# Altium schematic sheet 03-PeripheralPart-V2.3.SchDoc
size A4
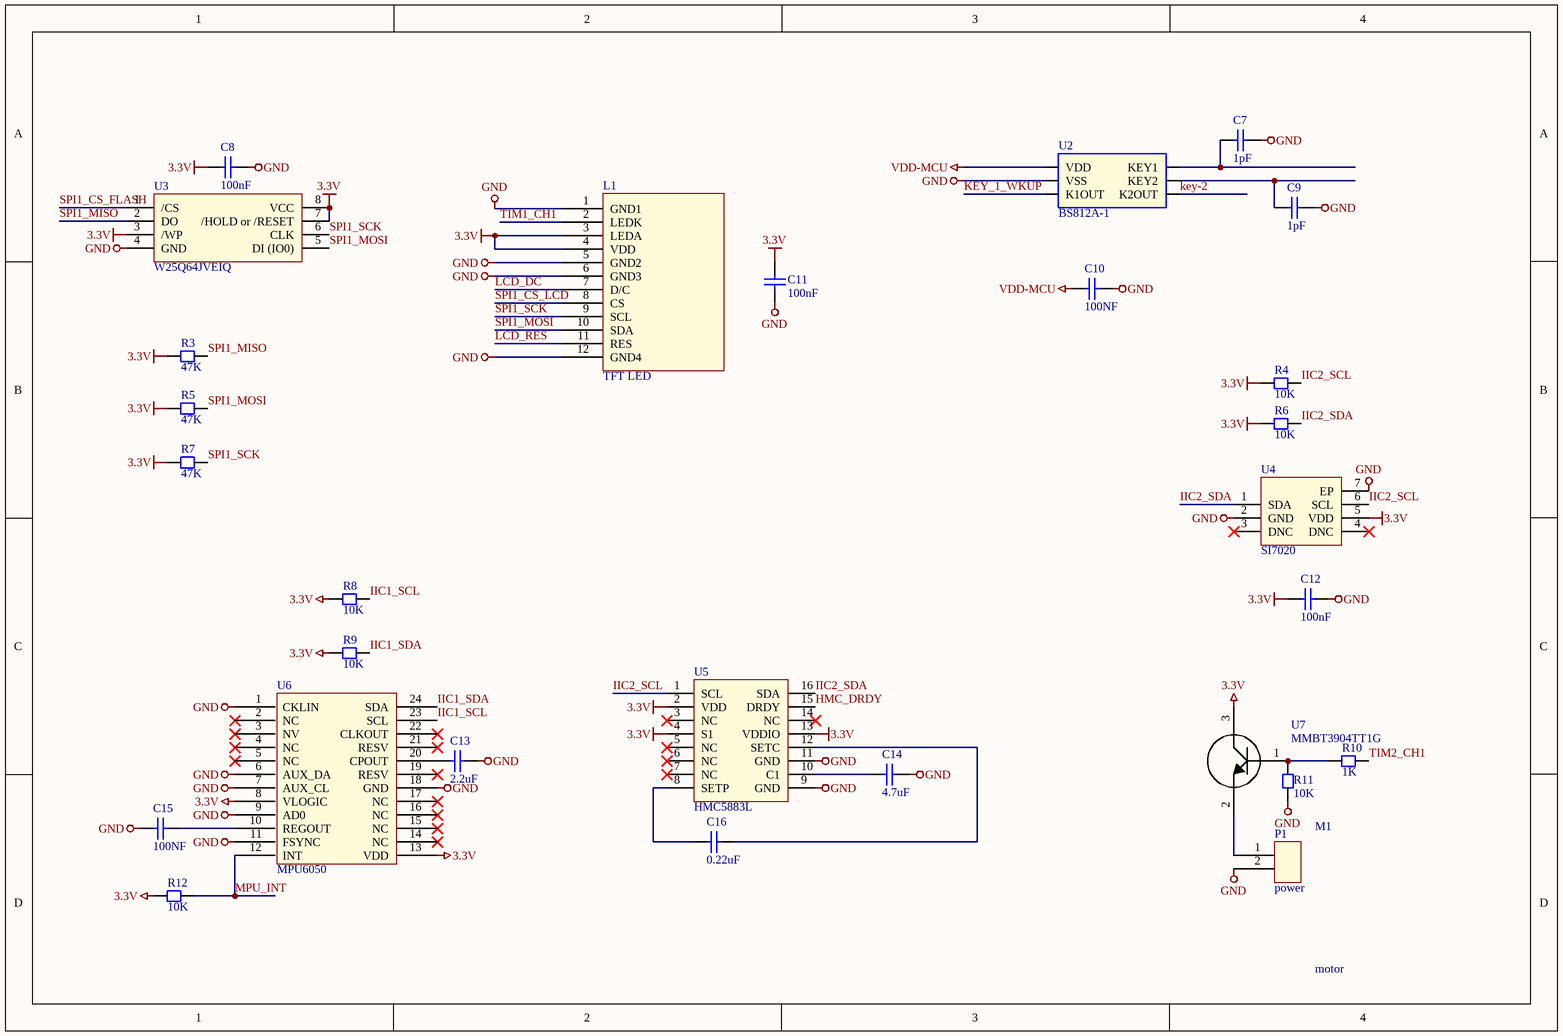
[diagram p0: 03-PeripheralPart-V2.3.SchDoc]

## Parts
C7  1pF  [CC1005-0402]
C8  100nF  [CC1005-0402]
C9  1pF  [CC1005-0402]
C10  100NF  [CC1005-0402]
C11  100nF  [CC1005-0402]
C12  100nF  [CC1005-0402]
C13  2.2uF  [CC1005-0402]
C14  4.7uF  [CC1005-0402]
C15  100NF  [CC1005-0402]
C16  0.22uF  [CC1005-0402]
L1  TFT LED  [LCD-1.3-(2)]
M1  motor  [motor]
P1  power  [POWER-3.7V]
R3  47K  [CR1005-0402]
R4  10K  [CR1005-0402]
R5  47K  [CR1005-0402]
R6  10K  [CR1005-0402]
R7  47K  [CR1005-0402]
R8  10K  [CR1005-0402]
R9  10K  [CR1005-0402]
R10  1K  [CR1005-0402]
R11  10K  [CR1005-0402]
R12  10K  [CR1005-0402]
U2  BS812A-1  [SOT23-6]
U3  W25Q64JVEIQ  [WSON-8_L8.0-W6.10-P1.27-TL-EP]
U4  SI7020  [DFN-6]
U5  HMC5883L  [LPCC-16_L3.0-W3.0-P0.50-BL]
U6  MPU6050  [QFN24 - duplicate]
U7  MMBT3904TT1G  [SOT-416]

## Nets
3.3V: C8.1 C11.1 C12.1 L1.3(LEDA) L1.4(VDD) R3.2 R4.2 R5.2 R6.2 R7.2 R8.2 R9.2 R12.2 U3.3(/WP) U3.7(/HOLD_or_/RESET) U3.8(VCC) U4.5(VDD) U5.2(VDD) U5.4(S1) U5.13(VDDIO) U6.8(VLOGIC) U6.13(VDD) U7.3
GND: C7.2 C8.2 C9.2 C10.1 C11.2 C12.2 C13.2 C14.2 C15.1 L1.1(GND1) L1.5(GND2) L1.6(GND3) L1.12(GND4) P1.2 R11.2 U2.2(VSS) U3.4(GND) U4.2(GND) U4.7(EP) U5.9(GND) U5.11(GND) U6.1(CKLIN) U6.6(AUX_DA) U6.7(AUX_CL) U6.9(AD0) U6.11(FSYNC) U6.18(GND)
VDD-MCU: C10.2 U2.1(VDD)
HMC_DRDY: U5.15(DRDY)
IIC1_SCL: R8.1 U6.23(SCL)
IIC1_SDA: R9.1 U6.24(SDA)
IIC2_SCL: R4.1 U4.6(SCL) U5.1(SCL)
IIC2_SDA: R6.1 U4.1(SDA) U5.16(SDA)
key-2: U2.4(K2OUT)
KEY_1_WKUP: U2.3(K1OUT)
LCD_DC: L1.7(D/C)
LCD_RES: L1.11(RES)
MPU_INT: R12.1 U6.12(INT)
SPI1_CS_FLASH: U3.1(/CS)
SPI1_CS_LCD: L1.8(CS)
SPI1_MISO: R3.1 U3.2(DO)
SPI1_MOSI: L1.10(SDA) R5.1 U3.5(DI_(IO0))
SPI1_SCK: L1.9(SCL) R7.1 U3.6(CLK)
TIM1_CH1: L1.2(LEDK)
TIM2_CH1: R10.1
NetC7_1: C7.1 U2.6(KEY1)
NetC9_1: C9.1 U2.5(KEY2)
NetC13_1: C13.1 U6.20(CPOUT)
NetC14_1: C14.1 U5.10(C1)
NetC15_2: C15.2 U6.10(REGOUT)
NetC16_1: C16.1 U5.8(SETP)
NetC16_2: C16.2 U5.12(SETC)
NetP1_1: P1.1 U7.2
NetR10_2: R10.2 R11.1 U7.1

Not connected (* = marked no-connect by the designer): U4 3(DNC)* 4(DNC)*; U5 3(NC)* 5(NC)* 6(NC)* 7(NC)* 14(NC)*; U6 2(NC)* 3(NV)* 4(NC)* 5(NC)* 14(NC)* 15(NC)* 16(NC)* 17(NC)* 19(RESV)* 21(RESV)* 22(CLKOUT)*

## Library data of the parts
C7-C16 = Chip capacitor: 贴片电容
L1 = LCD-IPSscreen-1.3: 1.3寸显示屏幕
M1 = motor: 震动马达
R3-R12 = Chip resistor: 贴片电阻
U2 = BS812A-1: 触摸按键 两路 SOP23-6封装极简电路
U3 = W25Q256JVEIQ: FLASH
U4 = SI7020: 温湿度传感器芯片
U5 = HMC5883L: 三轴罗盘
U6 = MPU6050: 陀螺仪
U7 = MMBT3904TT1G: NPN 电流 - 集电极（Ic）（最大值）：200mA 电压 - 集射极击穿（最大值）：40V SOT-23-3